# EAGLE design m1-data-register-b (EAGLE 9.6.1)
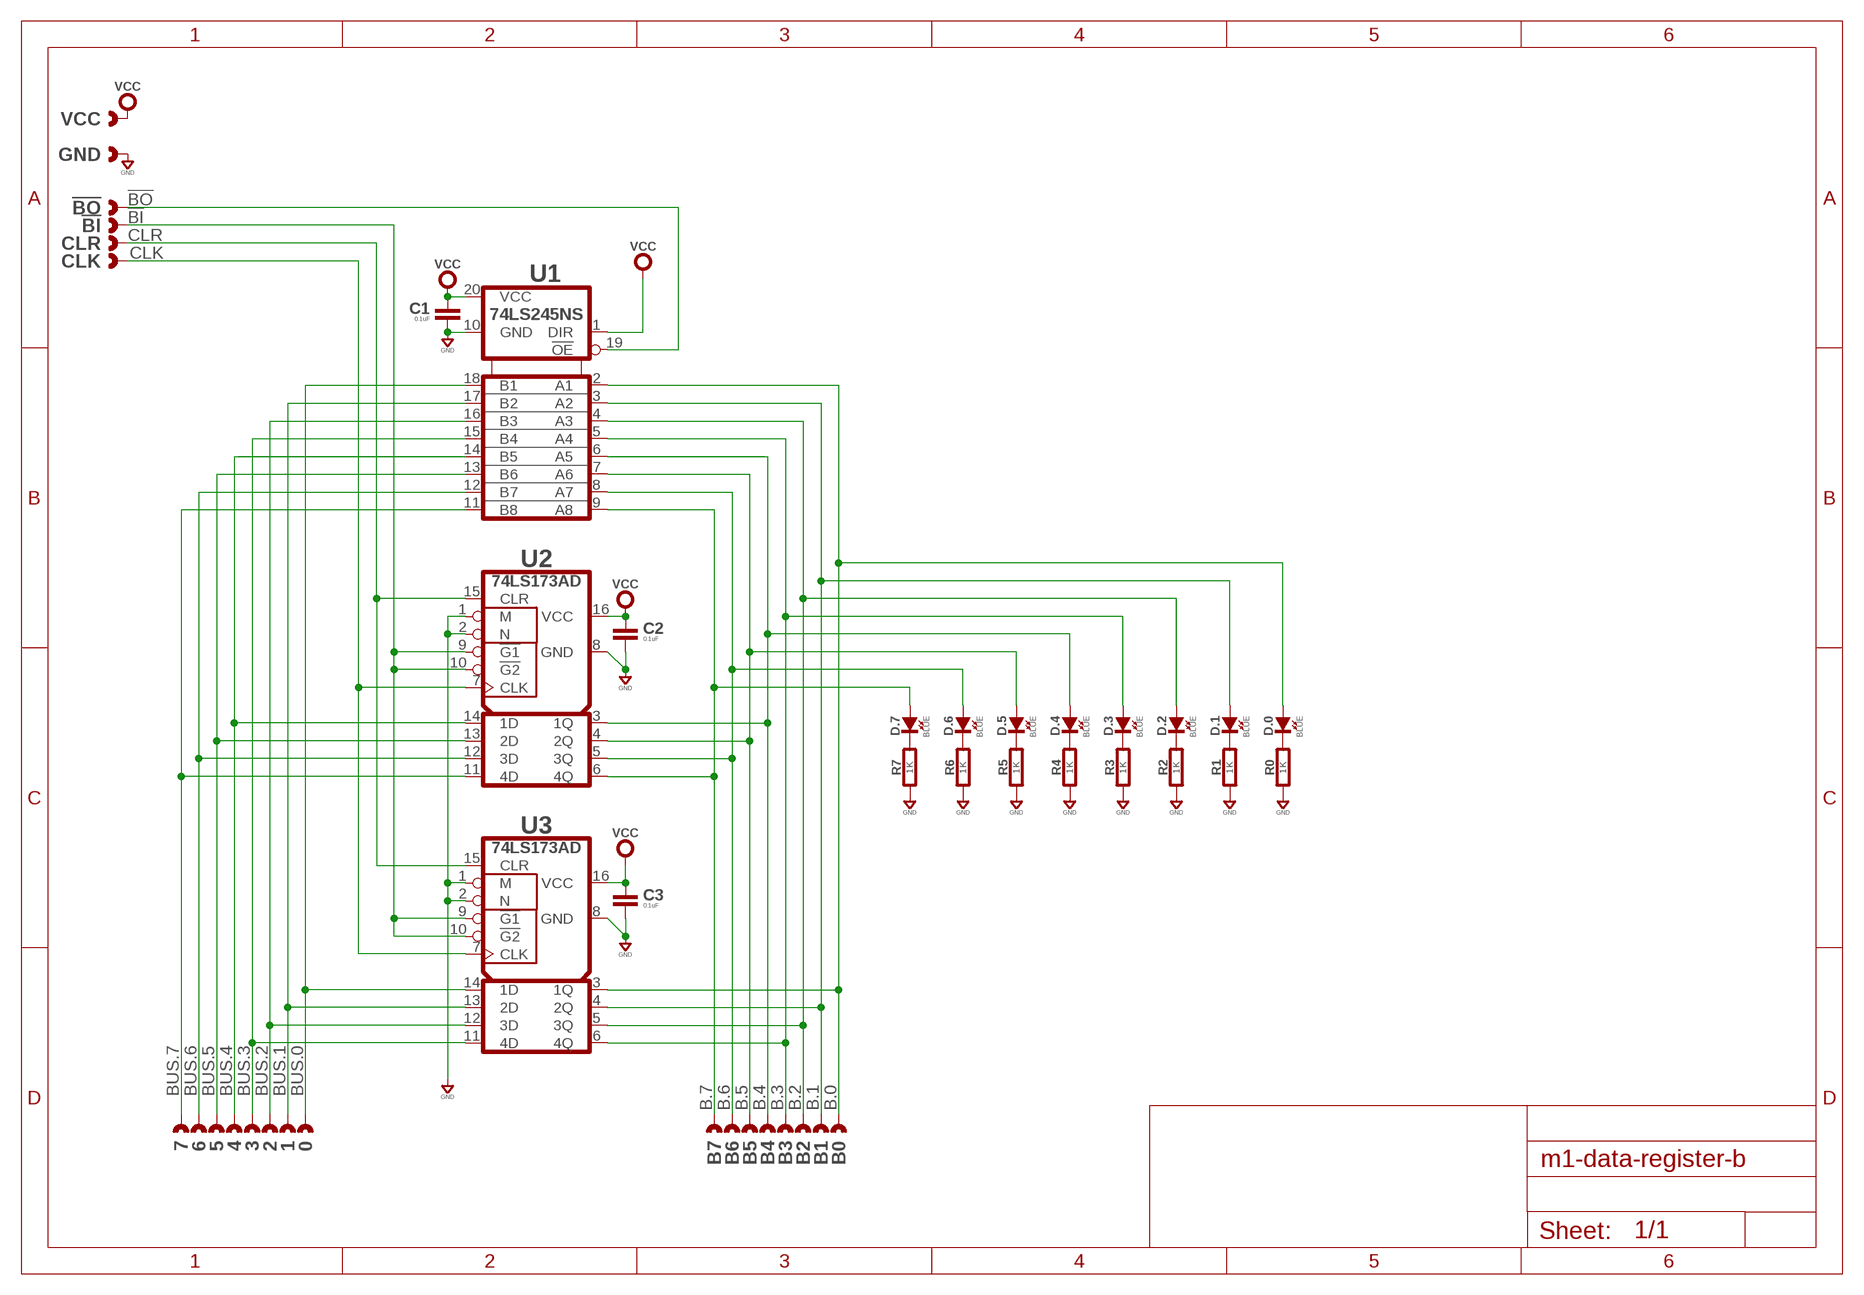
[diagram p0: schematic, sheet 1]

## Parts
0  CAST-01X1  [CAST01-2.54MM]
1  CAST-01X1  [CAST01-2.54MM]
2  CAST-01X1  [CAST01-2.54MM]
3  CAST-01X1  [CAST01-2.54MM]
4  CAST-01X1  [CAST01-2.54MM]
5  CAST-01X1  [CAST01-2.54MM]
6  CAST-01X1  [CAST01-2.54MM]
7  CAST-01X1  [CAST01-2.54MM]
!BI  CAST-01X1  [CAST01-2.54MM]
!BO  CAST-01X1  [CAST01-2.54MM]
B0  CAST-01X1  [CAST01-2.54MM]
B1  CAST-01X1  [CAST01-2.54MM]
B2  CAST-01X1  [CAST01-2.54MM]
B3  CAST-01X1  [CAST01-2.54MM]
B4  CAST-01X1  [CAST01-2.54MM]
B5  CAST-01X1  [CAST01-2.54MM]
B6  CAST-01X1  [CAST01-2.54MM]
B7  CAST-01X1  [CAST01-2.54MM]
C1  0.1uF  CAPACITOR0603  [0603-CAP]
C2  0.1uF  CAPACITOR0603  [0603-CAP]
C3  0.1uF  CAPACITOR0603  [0603-CAP]
CLK  CAST-01X1  [CAST01-2.54MM]
CLR  CAST-01X1  [CAST01-2.54MM]
D.0  BLUE  SMT0603  [SMD_0603]
D.1  BLUE  SMT0603  [SMD_0603]
D.2  BLUE  SMT0603  [SMD_0603]
D.3  BLUE  SMT0603  [SMD_0603]
D.4  BLUE  SMT0603  [SMD_0603]
D.5  BLUE  SMT0603  [SMD_0603]
D.6  BLUE  SMT0603  [SMD_0603]
D.7  BLUE  SMT0603  [SMD_0603]
GND  CAST-01X1  [CAST01-2.54MM]
R0  1K  RESISTOR0603  [0603-RES]
R1  1K  RESISTOR0603  [0603-RES]
R2  1K  RESISTOR0603  [0603-RES]
R3  1K  RESISTOR0603  [0603-RES]
R4  1K  RESISTOR0603  [0603-RES]
R5  1K  RESISTOR0603  [0603-RES]
R6  1K  RESISTOR0603  [0603-RES]
R7  1K  RESISTOR0603  [0603-RES]
U1  74LS245NS  [SO20]
U2  74LS173AD  [SO16]
U3  74LS173AD  [SO16]
VCC  CAST-01X1  [CAST01-2.54MM]

## Nets
!BI: !BI.1 U2.9(!G1) U2.10(!G2) U3.9(!G1) U3.10(!G2)
!BO: !BO.1 U1.19(!OE)
B.0: B0.1 D.0.A U1.2(A1) U3.3(1Q)
B.1: B1.1 D.1.A U1.3(A2) U3.4(2Q)
B.2: B2.1 D.2.A U1.4(A3) U3.5(3Q)
B.3: B3.1 D.3.A U1.5(A4) U3.6(4Q)
B.4: B4.1 D.4.A U1.6(A5) U2.3(1Q)
B.5: B5.1 D.5.A U1.7(A6) U2.4(2Q)
B.6: B6.1 D.6.A U1.8(A7) U2.5(3Q)
B.7: B7.1 D.7.A U1.9(A8) U2.6(4Q)
BUS.0: 0.1 U1.18(B1) U3.14(1D)
BUS.1: 1.1 U1.17(B2) U3.13(2D)
BUS.2: 2.1 U1.16(B3) U3.12(3D)
BUS.3: 3.1 U1.15(B4) U3.11(4D)
BUS.4: 4.1 U1.14(B5) U2.14(1D)
BUS.5: 5.1 U1.13(B6) U2.13(2D)
BUS.6: 6.1 U1.12(B7) U2.12(3D)
BUS.7: 7.1 U1.11(B8) U2.11(4D)
CLK: CLK.1 U2.7(CLK) U3.7(CLK)
CLR: CLR.1 U2.15(CLR) U3.15(CLR)
GND: C1.2 C2.2 C3.2 GND.1 R0.1 R1.1 R2.1 R3.1 R4.1 R5.1 R6.1 R7.1 U1.10(GND) U2.1(M) U2.2(N) U2.8(GND) U3.1(M) U3.2(N) U3.8(GND)
N$1: D.0.K(C) R0.2
N$2: D.1.K(C) R1.2
N$3: D.2.K(C) R2.2
N$4: D.3.K(C) R3.2
N$5: D.4.K(C) R4.2
N$6: D.5.K(C) R5.2
N$7: D.6.K(C) R6.2
N$8: D.7.K(C) R7.2
VCC: C1.1 C2.1 C3.1 U1.1(DIR) U1.20(VCC) U2.16(VCC) U3.16(VCC) VCC.1

## Library data of the parts
0 1-7 !BI !BO B0 B1-B7 CLK CLR GND VCC = con-headers:CAST-01X1: Castelated Edge Hole Pad
C1-C3 = rlc:CAPACITOR: Capacitor CAP
D.0 D.1-D.7 = led:SMT: LED SMT
R0 R1-R7 = rlc:RESISTOR: Resistor
U1 = logic:74*245?: 74245 Octal Transceiver
U2 U3 = logic:74*173A?: 74*173 Logic

## Board
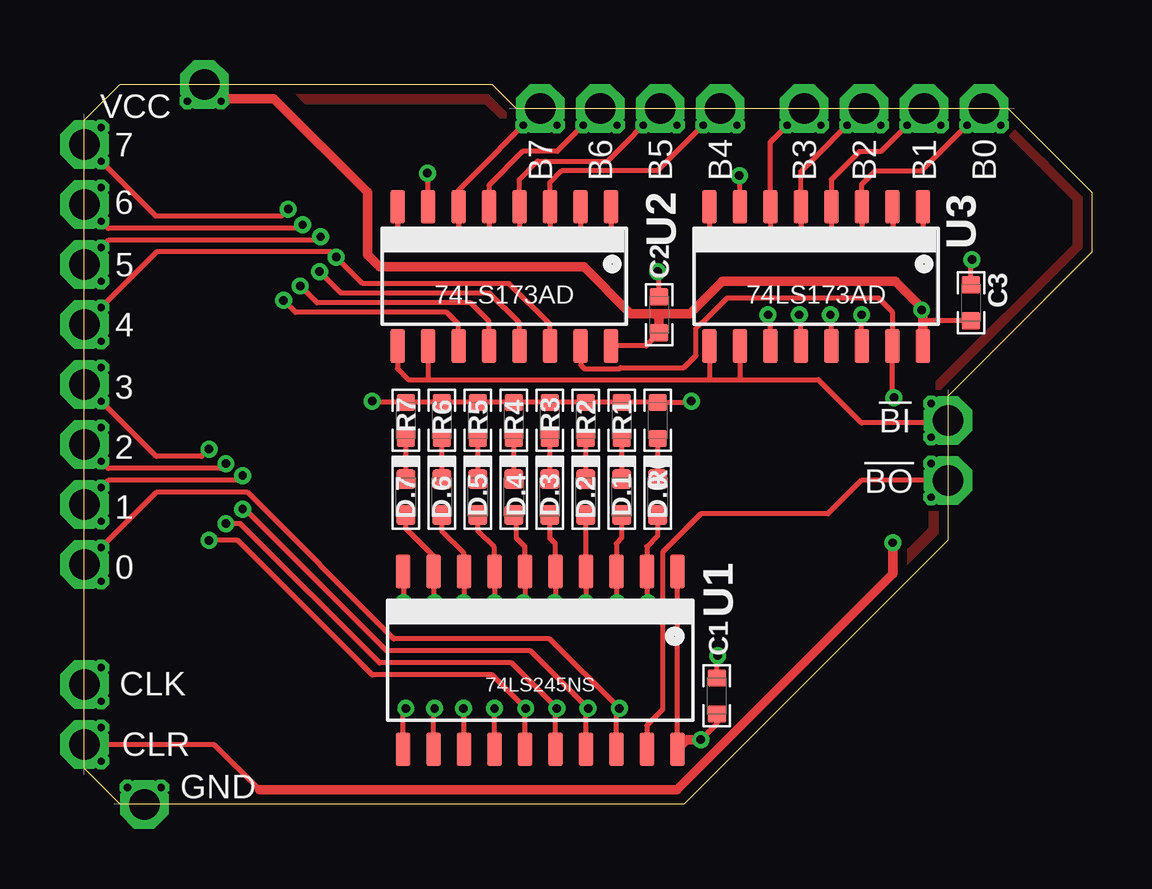
[diagram p1: board, top side]
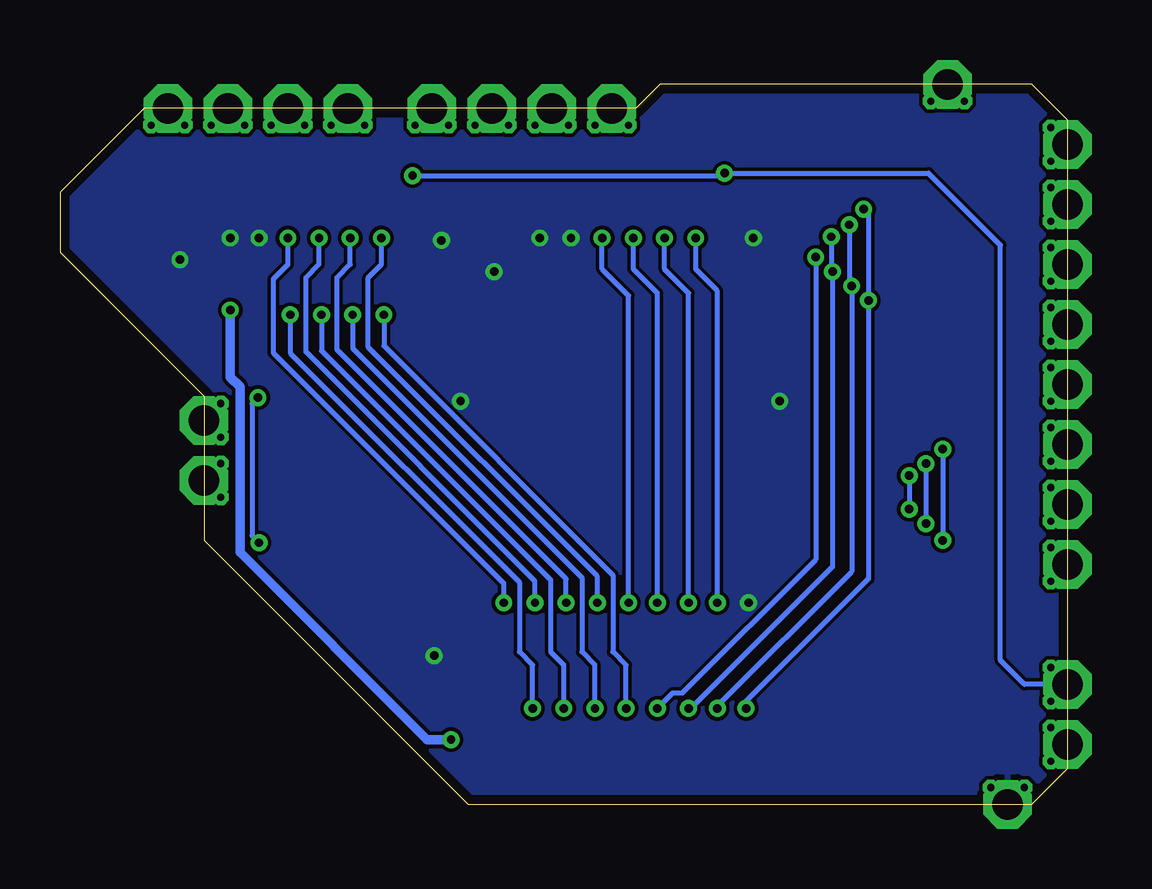
[diagram p2: board, bottom side, seen from below]

Size 42 x 30 mm. Coordinates in mm from the lower left corner, seen from the top.
Outline: 0,28.5 1.5,30 17,30 18,29 38.5,29 42,25.5 42,23 36,17 36,11 25,0 1.5,0 0,1.5 0,28.5
Copper layers (1*16): Top 0.0356mm / dielectric 1.5011mm / Bottom 0.0356mm
Design rules "OSH-CircuitMonkey *": minimum track width 6mil, minimum drill 12mil, track to track 6mil, track to pad 6mil, pad to pad 6mil, via to via 6mil, smd to smd 6mil, copper to edge 15mil, drill to drill 6mil, minimum pad ring 7mil, minimum via ring 7mil, stop-mask expansion 3mil, vias tented up to drill 14mil, thermal gap 10mil

### Footprints (pad centres in the part's own frame; a part is rotated, then mirrored left to right if it is on the bottom)
CAST01-2.54MM = drill 1.27 pad 2.032 octagon: 1 0,0 | drill 0.305 octagon: P$1 -0.7,0.7; P$2 -0.7,-0.7
0603-CAP = smd 0.711 x 0.762: 1 -0.752,0; 2 0.752,0
SMD_0603 = smd 0.8 x 0.8: A 0.75,0; K -0.75,0
0603-RES = smd 0.711 x 0.762: 1 -0.752,0; 2 0.752,0
SO20 = smd 0.6 x 1.4: 1 -5.715,-3.7; 2 -4.445,-3.7; 3 -3.175,-3.7; 4 -1.905,-3.7; 5 -0.635,-3.7; 6 0.635,-3.7; 7 1.905,-3.7; 8 3.175,-3.7; 9 4.445,-3.7; 10 5.715,-3.7; 11 5.715,3.7; 12 4.445,3.7; 13 3.175,3.7; 14 1.905,3.7; 15 0.635,3.7; 16 -0.635,3.7; 17 -1.905,3.7; 18 -3.175,3.7; 19 -4.445,3.7; 20 -5.715,3.7
SO16 = smd 0.6 x 1.4: 1 -4.445,-2.9; 2 -3.175,-2.9; 3 -1.905,-2.9; 4 -0.635,-2.9; 5 0.635,-2.9; 6 1.905,-2.9; 7 3.175,-2.9; 8 4.445,-2.9; 9 4.445,2.9; 10 3.175,2.9; 11 1.905,2.9; 12 0.635,2.9; 13 -0.635,2.9; 14 -1.905,2.9; 15 -3.175,2.9; 16 -4.445,2.9

### Placement (x,y rotation side)
0  0,10 180 top
1  0,12.5 180 top
2  0,15 180 top
3  0,17.5 180 top
4  0,20 180 top
5  0,22.5 180 top
6  0,25 180 top
7  0,27.5 180 top
!BI  36,16 0 top
!BO  36,13.5 0 top
B0  37.5,29 90 top
B1  35,29 90 top
B2  32.5,29 90 top
B3  30,29 90 top
B4  26.5,29 90 top
B5  24,29 90 top
B6  21.5,29 90 top
B7  19,29 90 top
C1  26.36,4.52 90 top
C2  23.96,20.4 90 top
C3  36.96,20.9 90 top
CLK  0,5 180 top
CLR  0,2.5 180 top
D.0  23.9,12.8 270 top
D.1  22.4,12.8 270 top
D.2  20.9,12.8 270 top
D.3  19.4,12.8 270 top
D.4  17.9,12.8 270 top
D.5  16.4,12.8 270 top
D.6  14.9,12.8 270 top
D.7  13.4,12.8 270 top
GND  2.5,0 270 top
R0  23.9,16 270 top
R1  22.4,16 270 top
R2  20.9,16 270 top
R3  19.4,16 270 top
R4  17.9,16 270 top
R5  16.4,16 270 top
R6  14.9,16 270 top
R7  13.4,16 270 top
U1  19,6 180 top
U2  17.5,22 180 top
U3  30.5,22 180 top
VCC  5,30 90 top

### Tracks (layer width: path | path; a pad name or v marks a point on that pad's centre or on a via)
!BI
  Top 0.2: U2.9 13.05,18.14 13.5,17.7 14.3,17.7 | 14.3,17.7 26.1,17.7 | 26.1,17.7 27.3,17.7 | 27.3,17.7 30.6,17.7 32.4,15.9 35.9,15.9 !BI.1 | U2.10 14.32,17.73 14.3,17.7 | U3.9 26.05,17.75 26.1,17.7 | U3.10 27.32,17.73 27.3,17.7
!BO
  Top 0.2: !BO.1 32.4,13.5 31,12.1 25.7,12.1 24.1,10.5 24.1,8.66 24.11,8.65 24.11,3.95 23.45,3.29 U1.19
AAA
  pour Top: 8.8,29.6 9.2,29.2 16.7,29.2 17.3,28.6 17.6,28.6 17.6,28.9 16.9,29.6
B.0  (via drill 0.35)
  Top 0.2: D.0.A 23.9,11.2 23.45,10.74 U1.2 23.45,8.46 v23.5,8.4 | B0.1 34.9,26.4 32.97,26.4 32.41,25.83 U3.3 32.41,23.7 v32.5,23.6
  Bottom 0.2: v23.5,8.4 23.5,9.2 33.1,18.8 33.1,21.9 32.5,22.5 v32.5,23.6
B.1  (via drill 0.35)
  Top 0.2: D.1.A 22.4,11.1 22.18,10.88 U1.3 22.18,8.43 v22.2,8.4 | B1.1 33.2,27.2 32.3,27.2 31.14,26.04 U3.4 31.14,23.66 v31.2,23.6
  Bottom 0.2: v22.2,8.4 22.2,9.3 31.75,18.85 31.75,21.95 31.2,22.5 v31.2,23.6
B.2  (via drill 0.35)
  Top 0.2: D.2.A 20.9,11.9 20.91,11.89 U1.4 v20.91,8.4 v20.9,8.4 | B2.1 29.86,26.36 U3.5 29.86,23.64 v29.9,23.6
  Bottom 0.2: v20.9,8.4 20.9,9.4 30.45,18.95 30.45,21.95 29.9,22.5 v29.9,23.6
B.3  (via drill 0.35)
  Top 0.2: D.3.A 19.4,11.1 19.64,10.87 U1.5 19.64,8.44 v19.6,8.4 | B3.1 28.59,27.59 U3.6 v28.59,23.61 v28.6,23.6
  Bottom 0.2: v19.6,8.4 19.6,9.5 29.15,19.05 29.15,21.95 28.6,22.5 v28.6,23.6
B.4  (via drill 0.35)
  Top 0.2: D.4.A 18,11.95 18,11.1 18.36,10.73 U1.6 18.36,8.46 v18.3,8.4 | B4.1 23.9,26.4 19.9,26.4 19.41,25.91 U2.3 v19.41,23.61 v19.4,23.6
  Bottom 0.2: v19.4,23.6 19.4,22.3 18.3,21.2 v18.3,8.4
B.5  (via drill 0.35)
  Top 0.2: D.5.A 16.4,11.4 17.09,10.71 U1.7 v17.09,8.4 v17.1,8.4 | B5.1 21.8,26.8 18.9,26.8 18.14,26.04 U2.4 18.14,23.64 v18.1,23.6
  Bottom 0.2: v18.1,23.6 18.1,22.3 17.1,21.3 v17.1,8.4
B.6  (via drill 0.35)
  Top 0.2: D.6.A 14.9,11.4 15.82,10.47 U1.8 15.82,8.43 v15.8,8.4 | B6.1 19.7,27.2 18.27,27.2 16.86,25.8 U2.5 16.86,23.66 v16.8,23.6
  Bottom 0.2: v15.8,8.4 15.8,21.3 16.8,22.3 v16.8,23.6
B.7  (via drill 0.35)
  Top 0.2: D.7.A 13.4,11.5 14.55,10.35 U1.9 14.55,8.45 v14.6,8.4 | B7.1 15.6,25.59 U2.6 15.6,23.7 v15.5,23.6
  Bottom 0.2: v14.6,8.4 14.6,21.4 15.5,22.3 v15.5,23.6
BUS.0  (via drill 0.35)
  Top 0.2: 0.1 3,13 6.8,13 12.9,6.9 19.4,6.9 v22.3,4 22.18,3.88 U1.18 | U3.14 v32.4,20.4
  Bottom 0.2: v22.3,4 22.3,5.8 22.85,6.35 22.85,9.25 32.4,18.8 v32.4,20.4
BUS.1  (via drill 0.35)
  Top 0.2: v6.6,12.3 6.7,12.3 12.6,6.4 18.6,6.4 v21,4 20.91,3.9 U1.17 | U3.13 31.14,20.36 v31.1,20.4 | 1.1 1,13.5 6.4,13.5 v6.6,13.7
  Bottom 0.2: v6.6,13.7 v6.6,12.3 | v21,4 21,5.8 21.55,6.35 21.55,9.35 31.1,18.9 v31.1,20.4
BUS.2  (via drill 0.35)
  Top 0.2: v5.9,11.7 6.5,11.7 12.3,5.9 17.8,5.9 v19.7,4 19.64,4 U1.16 | U3.12 29.86,20.34 v29.8,20.4 | v5.9,14.2 5.7,14 1,14 2.1
  Bottom 0.2: v5.9,14.2 v5.9,11.7 | v19.7,4 19.7,5.8 20.25,6.35 20.25,9.45 29.8,19 v29.8,20.4
BUS.3  (via drill 0.35)
  Top 0.2: v5.2,11 6.4,11 12,5.4 17,5.4 v18.4,4 18.36,3.96 U1.15 | U3.11 28.59,20.3 v28.5,20.4 | 3.1 3,14.5 4.9,14.5 v5.2,14.8
  Bottom 0.2: v5.2,14.8 v5.2,11 | v18.4,4 18.4,5.8 18.95,6.35 18.95,9.55 28.5,19.1 v28.5,20.4
BUS.4  (via drill 0.35)
  Top 0.2: 4.1 3.02,23.02 10.28,23.02 v10.5,22.8 11.6,21.7 17.7,21.7 19.41,20 U2.14 | U1.14 v17.09,4 v17.1,4
  Bottom 0.2: v10.5,22.8 10.5,10.2 16.05,4.65 16.45,4.65 v17.1,4
BUS.5  (via drill 0.35)
  Top 0.2: 5.1 1,23.5 9.7,23.5 v9.85,23.65 | U2.13 18.14,20.07 16.9,21.3 10.7,21.3 v9.8,22.2 | U1.13 15.82,3.98 v15.8,4
  Bottom 0.2: v15.8,4 15.7,4 9.8,9.9 v9.8,22.2 9.85,22.25 v9.85,23.65
BUS.6  (via drill 0.35)
  Top 0.2: v9.1,24.15 8.95,24 1,24 6.1 | U2.12 16.86,20.14 16.1,20.9 9.7,20.9 v9,21.6 | U1.12 14.55,3.96 v14.6,4
  Bottom 0.2: v9.1,24.15 9.1,21.7 v9,21.6 9,9.7 14.6,4.1 v14.6,4
BUS.7  (via drill 0.35)
  Top 0.2: v8.5,24.8 8.21,24.51 2.99,24.51 7.1 | U2.11 15.6,20 15.1,20.5 8.8,20.5 v8.3,21 | U1.11 13.29,3.88 v13.4,4
  Bottom 0.2: v8.5,24.8 8.3,24.6 v8.3,21 8.3,9.4 13.4,4.3 v13.4,4
CLK  (via drill 0.35)
  Top 0.2: U3.7 27.32,26.18 v27.3,26.2 | U2.7 14.32,26.27 v14.3,26.3
  Bottom 0.2: v27.3,26.2 14.4,26.2 v14.3,26.3 5.8,26.3 2.8,23.3 2.8,6 1.8,5 CLK.1
CLR  (via drill 0.35)
  Top 0.2: U2.15 20.7,19.07 20.7,18.3 20.85,18.15 22.3,18.15 22.35,18.2 25,18.2 25.5,18.7 25.5,19.85 25.7,20.05 25.75,20.05 26.8,21.1 33.1,21.1 33.67,20.52 U3.15 33.67,17.02 v33.75,16.95 | CLR.1 5.4,2.5 7.3,0.6
  Top 0.4: 7.3,0.6 24.7,0.6 33.7,9.6 v33.7,10.9
  Bottom 0.2: v33.7,10.9 34,11.2 34,16.7 v33.75,16.95
EEE
  pour Top: 35.5,17.3 35.7,17.3 41.6,23.2 41.6,25.3 38.8,28.1 38.55,27.85 41.2,25.2 41.2,23.3 35.5,17.6
FFF
  pour Top: 34.3,10 35.6,11.3 35.6,12.2 35.2,12.2 35.2,11.5 34.3,10.6
GND  (via drill 0.35)
  Top 0.2: U3.2 33.7,24.88 v33.7,23.6 | U3.1 34.95,23.64 v34.9,23.6 | U3.8 26.05,23.55 v26.1,23.5 | U2.1 21.95,23.66 v22,23.6 | U2.2 20.68,23.62 v20.7,23.6 | U2.8 13.05,23.64 v13.1,23.6 | v25.3,16.8 25.15,16.8 25.1,16.75 R0.1 R1.1 R2.1 R3.1 R4.1 R5.1 R6.1 R7.1 12.05,16.75 v12,16.8 | C3.2 36.96,22.66 v37,22.7 | C2.2 23.96,22.14 v23.9,22.2 | C1.2 26.36,6.16 v26.4,6.2 | U1.10 13.3,9.69 v13.3,8.4
  pour Bottom: 1.5,30 0,28.5 0,1.5 1.5,0 25,0 36,11 36,17 42,23 42,25.5 38.5,29 18,29 17,30
N$1
  Top 0.2: R0.2 D.0.K
N$2
  Top 0.2: R1.2 D.1.K
N$3
  Top 0.2: R2.2 D.2.K
N$4
  Top 0.2: R3.2 D.3.K
N$5
  Top 0.2: R4.2 D.4.K
N$6
  Top 0.2: R5.2 D.5.K
N$7
  Top 0.2: R6.2 D.6.K
N$8
  Top 0.2: R7.2 D.7.K
VCC  (via drill 0.35)
  Top 0.2: C2.1 23.41,19.1 U2.16 | C3.1 35,20.15 34.95,20.2 | C1.1 26.36,3.36 v25.7,2.7 | U1.20 U1.1
  Top 0.4: VCC.1 5.6,29.4 7.9,29.4 11.8,25.5 11.8,22.9 12.3,22.4 20.82,22.4 22.77,20.44 24,20.44 | 34.95,20.66 34.95,20.2 U3.16 | 24,20.44 25.24,20.44 26.6,21.8 33.8,21.8 34.95,20.66 | C2.1 23.96,20.4 24,20.44 | v34.9,20.6 v34.9,20.61 34.95,20.66 | U1.20 25.11,2.7 v25.7,2.7
  Bottom 0.4: v25.7,2.7 26.7,2.7 34.5,10.5 34.5,17.4 34.9,17.8 v34.9,20.6

### Text on the board
Reference: Vcc | 7 | B.7 | B.6 | B.5 | B.4 | B.3 | B.2 | B.1 | B.0 | 6 | 5 | 4 | 3 | !BI | 2 | !BO | 1 | 0 | CLK | CLR | GND